# EAGLE design espPixel (EAGLE 9.6.2)
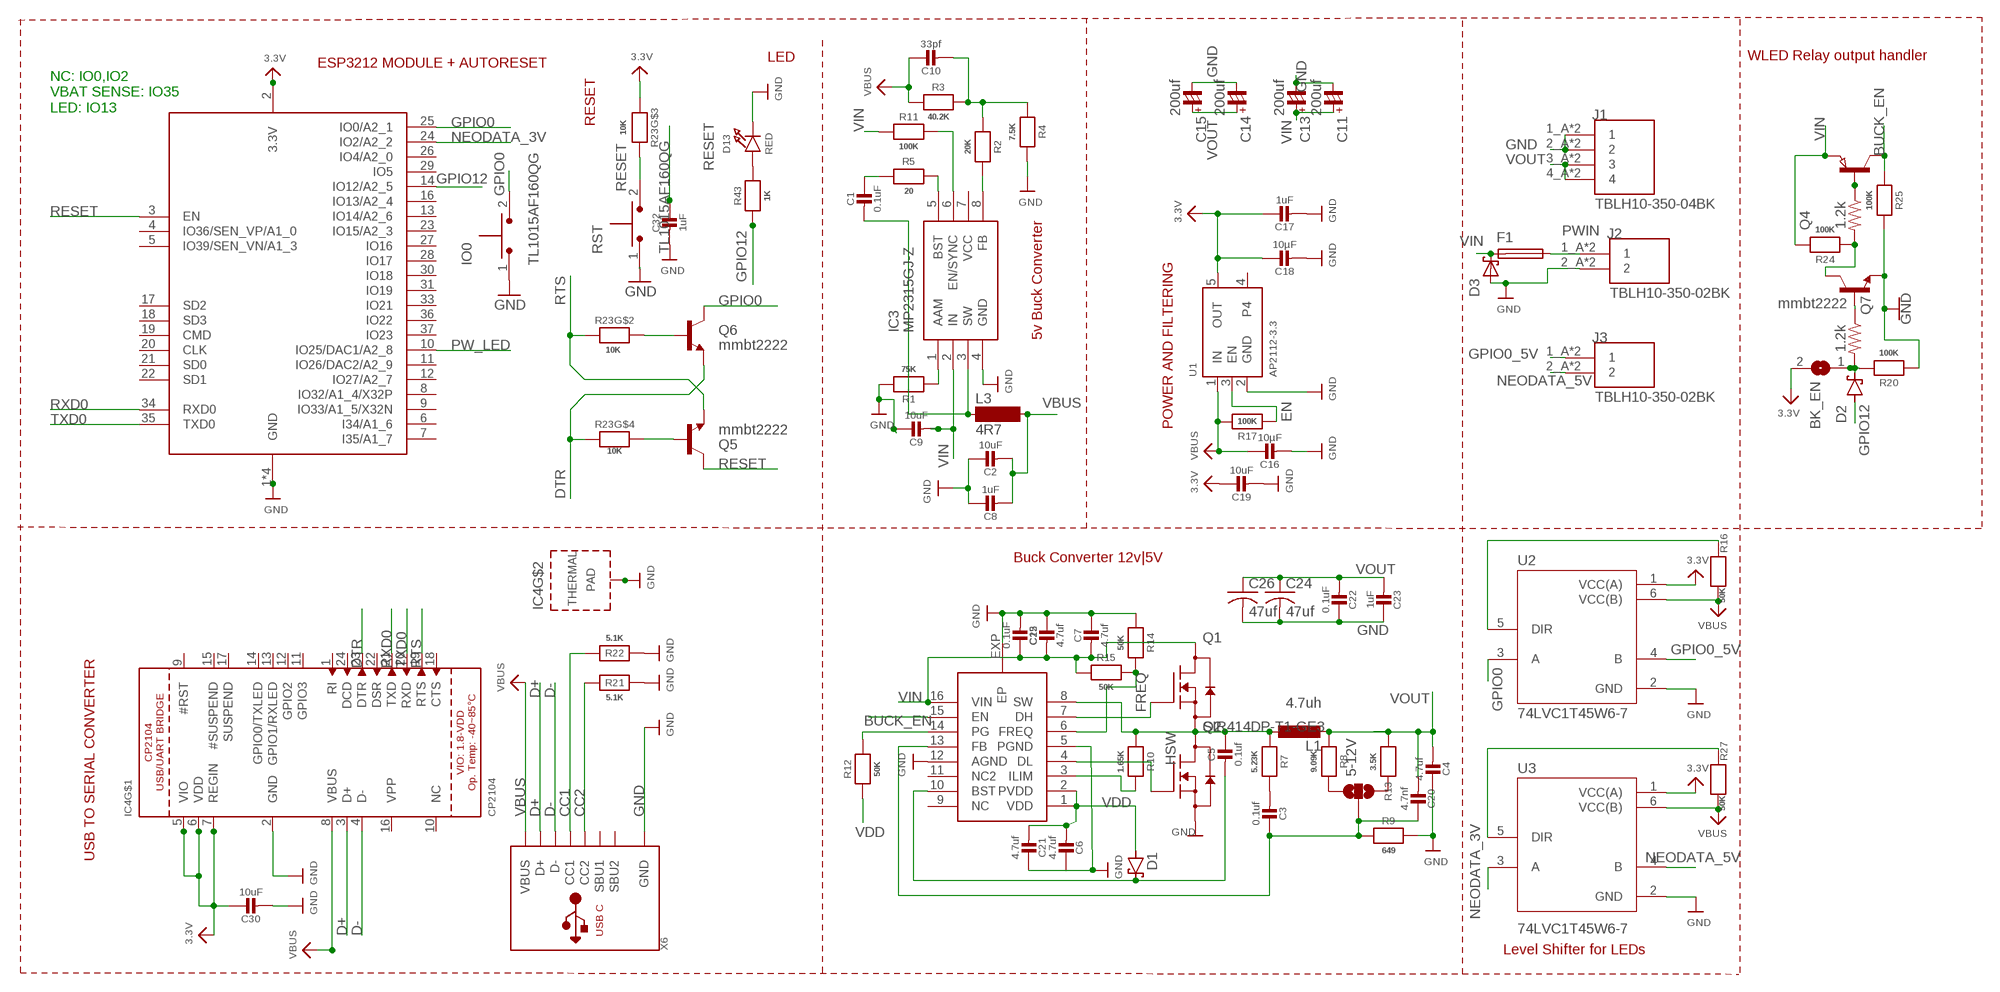
[diagram p0: schematic, sheet 1]

## Parts
5-12V  JUMPER-SMT_3_NO_NO-SILK  [SMT-JUMPER_3_NO_NO-SILK]
BK_EN  SJ  [SJ]
C1  0.1uF  CAP_CERAMIC0603_NO  [0603-NO@1]
C2  10uF  CAP_CERAMIC0603_NO  [0603-NO@1]
C3  0.1uf  CAP_CERAMIC0603_NO  [0603-NO@1]
C4  4.7uf  CAP_CERAMIC0805_10MGAP  [0805_10MGAP]
C5  0.1uf  CAP_CERAMIC0603_NO  [0603-NO@1]
C6  4.7uf  CAP_CERAMIC0603_NO  [0603-NO@1]
C7  4.7uf  CAP_CERAMIC0805_10MGAP  [0805_10MGAP]
C8  1uF  CAP_CERAMIC0603_NO  [0603-NO@1]
C9  10uF  CAP_CERAMIC0805_10MGAP  [0805_10MGAP]
C10  33pf  CAP_CERAMIC0603_NO  [0603-NO@1]
C11  200uf  CP_SV-E/F  [CSV-E/F]
C12  4.7uf  CAP_CERAMIC0805_10MGAP  [0805_10MGAP]
C13  200uf  CP_SV-E/F  [CSV-E/F]
C14  200uf  CP_SV-E/F  [CSV-E/F]
C15  200uf  CP_SV-E/F  [CSV-E/F]
C16  10µF  CAP_CERAMIC0805-NOOUTLINE  [0805-NO]
C17  1uF  CAP_CERAMIC0603_NO  [0603-NO@1]
C18  10µF  CAP_CERAMIC0805-NOOUTLINE  [0805-NO]
C19  10uF  CAP_CERAMIC0805-NOOUTLINE  [0805-NO]
C20  4.7nf  CAP_CERAMIC0603_NO  [0603-NO@1]
C21  4.7uf  CAP_CERAMIC0603_NO  [0603-NO@1]
C22  0.1uF  CAP_CERAMIC0603_NO  [0603-NO@1]
C23  1uF  CAP_CERAMIC0603_NO  [0603-NO@1]
C24  47uf  C-USC3225  [C3225]
C25  0.1uF  CAP_CERAMIC0603_NO  [0603-NO@1]
C26  47uf  C-USC3225  [C3225]
C30  10uF  CAP_CERAMIC0805-NOOUTLINE  [0805-NO]
C32  1uF  CAP_CERAMIC0603_NO  [0603-NO@1]
D1  BAT60J  [SOD323_ST]
D2  BAT60J  [SOD323_ST]
D3  SCHOTTKY-DIODESMC  [SMC]
D13  RED  LED0805_NOOUTLINE  [CHIPLED_0805_NOOUTLINE]
F1  SMD-MICRO-FUSE-BLOCK  [OMNIBLOK]
IC3  MP2315GJ-Z  [SOT65P280X100-8N]
IC4  CP2104  [QFN24_4MM_SMSC]
IO0  TL1015AF160QG  [SW_TL1015AF160QG]
J1  TBLH10-350-04BK  [CUI_TBLH10-350-04BK]
J2  TBLH10-350-02BK  [CUI_TBLH10-350-02BK]
J3  TBLH10-350-02BK  [CUI_TBLH10-350-02BK]
L1  4.7uh  L-EUCEP125  [CEP125]
L3  4R7  MS50  [MS50]
Q1  SIR414DP-T1-GE3  [TRANS_SQJ461EP-T1-GE3]
Q2  SIR414DP-T1-GE3  [TRANS_SQJ461EP-T1-GE3]
Q4  PNP-TRANSISTOR_SOT23  [SOT23]
Q5  mmbt2222  TRANSISTOR_NPNSOT23-3  [SOT23-3]
Q6  mmbt2222  TRANSISTOR_NPNSOT23-3  [SOT23-3]
Q7  mmbt2222  TRANSISTOR_NPNSOT23-3  [SOT23-3]
R1  75K  RESISTOR_0603_NOOUT  [0603-NO]
R2  20K  RESISTOR_0603_NOOUT  [0603-NO]
R3  40.2K  RESISTOR_0603_NOOUT  [0603-NO]
R4  7.5K  RESISTOR_0603_NOOUT  [0603-NO]
R5  20  RESISTOR_0603_NOOUT  [0603-NO]
R6  1.2k  RESISTOR0603  [0603]
R7  5.23K  RESISTOR_0603_NOOUT  [0603-NO]
R8  9.09K  RESISTOR_0603_NOOUT  [0603-NO]
R9  649  RESISTOR_0603_NOOUT  [0603-NO]
R10  1.65K  RESISTOR_0603_NOOUT  [0603-NO]
R11  100K  RESISTOR_0603_NOOUT  [0603-NO]
R12  50K  RESISTOR_0603_NOOUT  [0603-NO]
R13  3.5K  RESISTOR_0603_NOOUT  [0603-NO]
R14  50K  RESISTOR_0603_NOOUT  [0603-NO]
R15  50K  RESISTOR_0603_NOOUT  [0603-NO]
R16  50K  RESISTOR_0603_NOOUT  [0603-NO]
R17  100K  RESISTOR_0603_NOOUT  [0603-NO]
R19  1.2k  RESISTOR0603  [0603]
R20  100K  RESISTOR_0603_NOOUT  [0603-NO]
R21  5.1K  RESISTOR_0603_NOOUT  [0603-NO]
R22  5.1K  RESISTOR_0603_NOOUT  [0603-NO]
R23  10K  RESISTOR_4PACK  [RESPACK_4X0603]
R24  100K  RESISTOR_0603_NOOUT  [0603-NO]
R25  100K  RESISTOR_0603_NOOUT  [0603-NO]
R27  50K  RESISTOR_0603_NOOUT  [0603-NO]
R43  1K  RESISTOR_0603_NOOUT  [0603-NO]
RST  TL1015AF160QG  [SW_TL1015AF160QG]
U1  AP2112-3.3  VREG_SOT23-5  [SOT23-5]
U2  74LVC1T45W6-7  [SOT95P285X140-6N]
U3  74LVC1T45W6-7  [SOT95P285X140-6N]
U$1  MIC2101QFN16  [QFN16]
X6  USB_C  [USB_C_CUSB31-CFM2AX-01-X]
X8  ESP32_WROOM32_SKINNY  [WROOM32_SKINNY]

## Nets
3.3V: BK_EN.2 C17.1 C18.1 C19.1 C30.1 IC4.5(VIO) IC4.6(VDD) IC4.7(REGIN) R23.3 U1.5(OUT) U2.1(VCC(A)) U3.1(VCC(A)) X8.2(3.3V)
BUCK_EN: Q4.3(C) R25.1 U$1.15(EN)
CC1: R22.2 X6.A5(CC1)
CC2: R21.2 X6.B5(CC2)
D+: IC4.3(D+) X6.A6(D+) X6.B6(D+)
D-: IC4.4(D-) X6.A7(D-) X6.B7(D-)
DTR: IC4.23(DTR) Q6.2(E) R23.4
EN: R17.1 U1.3(EN)
FREQ: R14.2 R15.2 U$1.6(FREQ)
GND: C2.1 C4.1 C6.1 C7.1 C8.1 C9.1 C11.- C12.1 C13.- C14.- C15.- C16.2 C17.2 C18.2 C19.2 C21.1 C22.1 C23.1 C24.2 C25.2 C26.2 C30.2 C32.2 D3.A D13.C IC3.4(GND) IC4.2(GND) IC4.THERM(TP) IO0.1 J1.1_A J1.1_B J1.2_A J1.2_B J2.2_A J2.2_B Q2.1(S) Q2.2(S) Q2.3(S) Q7.2(E) R1.2 R4.2 R9.2 R14.1 R20.1 R21.1 R22.1 R25.2 RST.1 U1.2(GND) U2.2(GND) U3.2(GND) U$1.5(PGND) U$1.12(AGND) U$1.EXP(EP) X6.A1B12(GND) X6.B1A12(GND) X8.1(GND) X8.15(GND) X8.38(GND) X8.P$1(GND)
GPIO0: IO0.2 Q6.3(C) U2.3(A) X8.25(IO0/A2_1)
GPIO0_5V: J3.1_A J3.1_B U2.4(B)
GPIO12: D2.A R43.1 X8.14(IO12/A2_5)
HSW: C5.1 L1.1 Q1.1(S) Q1.2(S) Q1.3(S) Q2.5(D) Q2.6(D) Q2.7(D) Q2.8(D) Q2.9(D) R7.1 R10.1 U$1.8(SW)
N$1: IC3.8(FB) R2.2
N$2: C10.2 R2.1 R3.2 R4.1
N$3: IC3.5(BST) R5.2
N$4: IC3.1(AAM) R1.1
N$5: IC3.6(EN/SYNC) R11.2
N$6: C1.1 R5.1
N$7: R12.2 U$1.14(PG)
N$8: C3.2 R7.2
N$9: BK_EN.1 D2.C R6.2 R20.2
N$10: R27.1 U3.5(DIR)
N$11: 5-12V.2 C3.1 C20.1 R9.1 U$1.13(FB)
N$12: Q2.4(G) U$1.4(DL)
N$13: Q1.4(G) U$1.7(DH)
N$14: R10.2 U$1.3(ILIM)
N$15: C5.2 D1.C U$1.10(BST)
N$17: 5-12V.1 R8.2
N$18: 5-12V.3 R13.2
N$21: D13.A R43.2
N$23: Q7.1(B) R6.1
N$24: Q4.1(B) R19.1
N$25: C1.2 IC3.3(SW) L3.1
N$26: Q7.3(C) R19.2 R24.1
N$28: R16.1 U2.5(DIR)
N$45: Q5.1(B) R23.5
N$48: Q6.1(B) R23.7
NEODATA_3V: U3.3(A) X8.24(IO2/A2_2)
NEODATA_5V: J3.2_A J3.2_B U3.4(B)
PW_LED: X8.10(IO25/DAC1/A2_8)
PWIN: F1.P$1 J2.1_A J2.1_B
RESET: C32.1 Q5.3(C) R23.6 RST.2 X8.3(EN)
RTS: IC4.19(RTS) Q5.2(E) R23.2
RXD0: IC4.21(TXD) X8.34(RXD0)
TXD0: IC4.20(RXD) X8.35(TXD0)
VBUS: C2.2 C8.2 C10.1 C16.1 IC4.8(VBUS) L3.2 R3.1 R16.2 R17.2 R27.2 U1.1(IN) U2.6(VCC(B)) U3.6(VCC(B)) X6.A4B9(VBUS) X6.B4A9(VBUS)
VDD: C6.2 C21.2 D1.A R12.1 U$1.1(VDD) U$1.2(PVDD)
VIN: C7.2 C9.2 C11.+ C12.2 C13.+ C25.1 D3.C F1.P$2 IC3.2(IN) Q1.5(D) Q1.6(D) Q1.7(D) Q1.8(D) Q1.9(D) Q4.2(E) R11.1 R15.1 R24.2 U$1.16(VIN)
VOUT: C4.2 C14.+ C15.+ C20.2 C22.2 C23.2 C24.1 C26.1 J1.3_A J1.3_B J1.4_A J1.4_B L1.2 R8.1 R13.1
Unconnected: IC3.7(VCC) IC4.1(RI) IC4.9(#RST) IC4.10(NC) IC4.11(GPIO3) IC4.12(GPIO2) IC4.13(GPIO1/RXLED) IC4.14(GPIO0/TXLED) IC4.15(#SUSPEND) IC4.16(VPP) IC4.17(SUSPEND) IC4.18(CTS) IC4.22(DSR) IC4.24(DCD) R23.1 R23.8 U1.4 U$1.9(NC) U$1.11(NC2) X6.A8(SBU1) X6.B8(SBU2) X8.4(IO36/SEN_VP/A1_0) X8.5(IO39/SEN_VN/A1_3) X8.6(I34/A1_6) X8.7(I35/A1_7) X8.8(IO32/A1_4/X32P) X8.9(IO33/A1_5/X32N) X8.11(IO26/DAC2/A2_9) X8.12(IO27/A2_7) X8.13(IO14/A2_6) X8.16(IO13/A2_4) X8.17(SD2) X8.18(SD3) X8.19(CMD) X8.20(CLK) X8.21(SD0) X8.22(SD1) X8.23(IO15/A2_3) X8.26(IO4/A2_0) X8.27(IO16) X8.28(IO17) X8.29(IO5) X8.30(IO18) X8.31(IO19) X8.33(IO21) X8.36(IO22) X8.37(IO23)

## Notes on the sheet
- WLED Relay output handler
- LED
- ESP3212 MODULE + AUTORESET
- NC: IO0,IO2
  VBAT SENSE: IO35
  LED: IO13
- RESET
- 5v Buck Converter
- POWER AND FILTERING
- Buck Converter 12v|5V
- USB TO SERIAL CONVERTER
- Level Shifter for LEDs

## Library data of the parts
5-12V = SparkFun-Jumpers:JUMPER-SMT_3_NO: Normally open jumper This jumper has three pads in close proximity to each other. Apply solder to close the connection(s).
BK_EN = jumper:SJ: SMD solder JUMPER
C1-C10 C12 C16-C23 C25 C30 C32 = microbuilder:CAP_CERAMIC: Ceramic Capacitors For new designs, use the packages preceded by an '_' character since they are more reliable: The following footprints should be used on most boards: _0402 - Standard footprint for regular board layouts _0603 - Standard footprint for regular board layouts _0805 - Standard footprint for regular board layouts _1206 - Standard footprint for regular board layouts For extremely tight-pitch boards where space is at a premium, the following 'micro-pitch' footprints can be used (smaller pads, no silkscreen outline, etc.): _0402MP - Micro-pitch footprint for very dense/compact boards _0603MP - Micro-pitch footprint for very dense/compact boards _0805MP - Micro-pitch footprint for very dense/compact boards _1206MP - Micro-pitch footprint for very dense/compact boards
C11 C13-C15 = rc-master-smd:CP_: POLARIZED CAP
C24 C26 = adafruit:C-US: CAPACITOR, American symbol
D1 D2 = diode:BAT60J: Schottky barrier diode Source: www.st.com, BAT60J.pdf
D3 = diode:SCHOTTKY-DIODE: Schottky Diode
D13 = microbuilder:LED: LED 0603 - 0603 Surface Mount Package 2mA: Green LED - Low Power (3.9mcd, 2ma, 1.7Vf) - Digikey: 475-2709-2-ND Orange LED - Low Power (9.8mcd, 2ma, 1.8Vf) - Digikey: 475-1194-2-ND Red LED - Low Power (5mcd, 2ma, 1.8Vf) - Digikey: 475-1195-2-ND Yellow LED - Low Power (7mcd, 2ma, 1.8Vf) - Digikey: 475-1196-2-ND 5mA: Blue LED - Low Power (17mcd, 5ma, 2.9Vf) - Digikey: LNJ937W8CRACT-ND 0805 - 0805 Surface Mount Package 2mA: Red LED (8.8mcd, 2mA, 1.8Vf, Clear) - Low Power [Digikey: 475-2510-1-ND] Green LED (5mcd, 2mA, 1.8Vf, Clear) - Low Power [Digikey: 475-2730-1-ND] Yellow LED (11.3mcd, 2mA, 1.8Vf, Clear) - Low Power [Digikey: 475-2555-1-ND] 20mA: Red LED (104mcd, 20mA, Diffused) - LS R976 [Digikey: 475-1278-6-ND] Red LED (12mcd, 20mA, 2.0Vf, Clear) - APT2012EC [Digikey: 754-1128-1-ND] Green LED (15mcd, 20mA, 2.2Vf, Clear) - APT2012GC [Digikey: 754-1131-1-ND] Orange LED (160mcd, 20mA, 2.1Vf, Clear) - APT2012SECK [Digikey: 754-1130-1-ND] 1206 - 1206 Surface Mount Package Green LED (26mcd, 20mA, Diffused) - LG N971 [Digikey: 475-1407-6-ND] Red LED (15mcd, 20mA, Diffused) - LH N974 [Digikey: 475-1416-6-ND] Cree - Cree High-Power Surface Mount LEDs XPEBWT-L1-0000-00D50 - White 111lm 350mA 2.9Vf 6200K 110° XTEAWT-00-0000-00000LEE3 - White 114lm 350mA 2.85Vf 5000K 115° Everlight - Everlight 45-21 Series Surface Mount LEDs 45-21/QK2C-B2832AC2CB2/2T - Warm White 2000mcd 20mA 3.25Vf 3050K 120° 45-21/LK2C-B38452C4CB2/2T - Nuetral White 2000mcd 20mA 3.25Vf 4150K 120° 45-21/LK2C-B50634C6CB2/2T - Cold White 2200mcd 20mA 3.25Vf 5650K 120° PLCC2 Reverse Mount LS T77K-J1L2-1-0-2-R18-Z - Red 11.25mcd 2mA 1.8Vf 630nm 120° LO T77K-L1M2-24-Z - Orange 19.6mcd 2mA 1.8Vf 606nm 120° LY T77K-K2M1-26-Z - Yellow 15.7mcd 2mA 1.8Vf 587nm 120°
F1 = f-lf-omniblok-s:SMD-MICRO-FUSE
IC3 = MP2315GJ-Z:MP2315GJ-Z: Switching Voltage Regulators 3A 24V 500kHz Sync buck Source: Datasheet <https://componentsearchengine.com/Datasheets/1/MP2315GJ-Z.pdf>; DESCRIPTION: Switching Voltage Regulators 3A 24V 500kHz Sync buck; HEIGHT: 1mm; MANUFACTURER_NAME: Monolithic Power Systems (MPS); MANUFACTURER_PART_NUMBER: MP2315GJ-Z; MOUSER_PART_NUMBER: 946-MP2315GJZ; MOUSER_PRICE-STOCK: https://www.mouser.co.uk/ProductDetail/Monolithic-Power-Systems-MPS/MP2315GJ-Z?qs=QEkzKklKf2QEN5VKd%252Br2GQ%3D%3D
IC4 = microbuilder:CP2104: CP2104 - USB to UART Bridge VDD Output: 3.45V
IO0 RST = TL1015AF160QG:TL1015AF160QG: Tactile Switch SPST-NO Top Actuated Surface Mount; AVAILABILITY: Unavailable; DESCRIPTION: Tactile Switch SPST-NO Top Actuated Surface Mount; MF: E-Switch; MP: TL1015AF160QG; PACKAGE: SOIC-14 E-Switch; PRICE: None
J1 = TBLH10-350-04BK:TBLH10-350-04BK; AVAILABILITY: Unavailable; CUI_PURCHASE_URL: https://www.cuidevices.com/product/interconnect/connectors/terminal-blocks/tblh10-350-series?utm_source=snapeda.com&utm_medium=referral&utm_campaign=snapedaBOM; DESCRIPTION: 2~24 Poles, Screwless, Horizontal, 3.50 Pitch, 24~16 (AWG), Terminal Block Connector; DIGIKEY-PURCHASE-URL: https://snapeda.com/shop?store=DigiKey&id=3655790; MF: CUI Devices; MP: TBLH10-350-04BK; PACKAGE: None; PRICE: None
J2 J3 = TBLH10-350-02BK:TBLH10-350-02BK; AVAILABILITY: Unavailable; CUI_PURCHASE_URL: https://www.cuidevices.com/product/interconnect/connectors/terminal-blocks/tblh10-350-series?utm_source=snapeda.com&utm_medium=referral&utm_campaign=snapedaBOM; DESCRIPTION: 2~24 Poles, Screwless, Horizontal, 3.50 Pitch, 24~16 (AWG), Terminal Block Connector; DIGIKEY-PURCHASE-URL: https://snapeda.com/shop?store=DigiKey&id=3655793; MF: CUI Devices; MP: TBLH10-350-02BK; PACKAGE: None; PRICE: None
L1 = rcl:L-EU: INDUCTOR, European symbol; SPICEPREFIX: L
L3 = inductor-neosid:MS50: INDUCTOR SMD power inductor; OC_FARNELL: unknown; OC_NEWARK: unknown
Q1 Q2 = SIR414DP-T1-GE3:SIR414DP-T1-GE3: Single N-Channel 40 V 0.0028 Ohm SMT TrenchFET Power Mosfet - PowerPak-SO-8; AVAILABILITY: Unavailable; DESCRIPTION: N-Channel 40V 50A (Tc) 5.4W (Ta), 83W (Tc) Surface Mount PowerPAK® SO-8; MF: Vishay Siliconix; MP: SIR414DP-T1-GE3; PACKAGE: SO-8 Vishay Siliconix; PRICE: None
Q4 = semicon-smd-ipc:PNP-TRANSISTOR_: PNP TRANSISTOR
Q5-Q7 = SparkFun:TRANSISTOR_NPN: Transistor NPN BJT configuration in SOT23 package. MMBT2222 is the common NPN we use. Double check BCE configuration again layout.
R1-R5 R7-R17 R20-R22 R24 R25 R27 R43 = microbuilder:RESISTOR: Resistors For new designs, use the packages preceded by an '_' character since they are more reliable: The following footprints should be used on most boards: _0402 - Standard footprint for regular board layouts _0603 - Standard footprint for regular board layouts _0805 - Standard footprint for regular board layouts _1206 - Standard footprint for regular board layouts For extremely tight-pitch boards where space is at a premium, the following 'micro-pitch' footprints can be used (smaller pads, no silkscreen outline, etc.): _0402MP - Micro-pitch footprint for very dense/compact boards _0603MP - Micro-pitch footprint for very dense/compact boards _0805MP - Micro-pitch footprint for very dense/compact boards _1206MP - Micro-pitch footprint for very dense/compact boards
R6 R19 = SparkFun-Resistors:RESISTOR: Generic Resistor Package
R23 = microbuilder:RESISTOR_4PACK: Resistor Packs (4 resistors) 4 x 0603 10K 1/16W - Digikey: YC164J-10KCT-ND
U1 = microbuilder:VREG_SOT23-5: SOT23-5 Fixed Voltage Regulators Part Current Out V Out V In V Dropout θJA (°C/W) TJ (°C) Digikey Part No. ADP121 150mA 3.3V 3.4-5.5V 0.09V @ 150mA -- -- ADP121-AUJZ33R7CT-ND ADP121 150mA 3.0V 3.1-5.5V 0.09V @ 150mA -- -- ADP121-AUJZ30R7CT-ND ADP122 300mA 3.3V 3.4-5.5V 0.085V @ 300mA -- -- ADP122AUJZ-3.3-R7CT-ND ADP1712 300mA 3.3V 3.5-5.5V 0.17V @ 300mA -- -- ADP1712AUJZ-3.3-R7TR-ND AP7311 (Low Cost) 150mA 3.3V 3.5-6V 0.15V @ 150mA -- -- AP7311-33WG-7DICT-ND LD39015M18R 150mA 1.8V 1.9V-5.5V 0.08V @ 100mA -- -- 497-6977-1-ND LP2985A-33DBVR 150mA 3.3V 3.3-16V 0.28V @ 150mA 206 150 296-18479-1-ND MCP1824T-3302E/OT 300mA 3.3V 3.5V-6V 0.2V @ 300mA -- -- MCP1824T-3302E/OTCT-ND MIC5205-2.5YM5 TR 150mA 2.5V 2.7-16V 0.165V @ 150mA -- -- 576-1257-2-ND MIC5205-3.0YM5 TR 150mA 3.0V 3.2V-16V 0.165V @ 150mA -- -- 576-1258-2-ND MIC5205-3.3YM5 TR 150mA 3.3V 3.5V-16V 0.165V @ 150mA -- -- 576-1259-2-ND TPS780330220 150mA 3.3V+2.2V 3.6-5.5V 250mV Max -- -- 296-23332-1-ND TDA3663/N1,135 100mA 3.3V 3.5-45V 0.18V @ 50mA -- -- 568-5343-1-ND Max operating temp can be calculated using θJA, TJ (max junction temperature), and power in watts. Set the "Maximum Ambient Temperature" until it reaches TJ ("Max Junction Temperature"), which is the absolute limit for safe use of the regulator: Heat Sink Temperature Calculator <http://www.daycounter.com/Calculators/Heat-Sink-Temperature-Calculator.phtml> For example, With 12V source into a 3.3V LP2985 and a 30mA load, we are dissipating (12V-3.3V) * 0.03A = 0.261W. With a θJA of 206 °C/W, a TJ of 150°C, and 261mW we can safely use the chip without a heat sink up to 75°C (=147.1°C Junction Temperature).
U2 U3 = 74LVC1T45W6-7:74LVC1T45W6-7: 74LVC Series 5.5 V 3-State SMT Single Bit Dual Supply Transceiver - SOT-26 Check prices <https://pricing.snapeda.com/parts/74LVC1T45W6-7/Diodes%20Inc./view-part?ref=eda>; AVAILABILITY: Warning; DESCRIPTION: Voltage Level Translator Bidirectional 1 Circuit 1 Channel SOT-26; MF: Diodes Inc.; MP: 74LVC1T45W6-7; PACKAGE: SOT-23-6 Diodes Inc.; PRICE: None; PURCHASE-URL: https://pricing.snapeda.com/search/part/74LVC1T45W6-7/?ref=eda
U$1 = MIC2101:MIC2101
X6 = microbuilder:USB_C: USB Type-C USB 2.0 Connector
X8 = microbuilder:ESP32_WROOM32

## Board
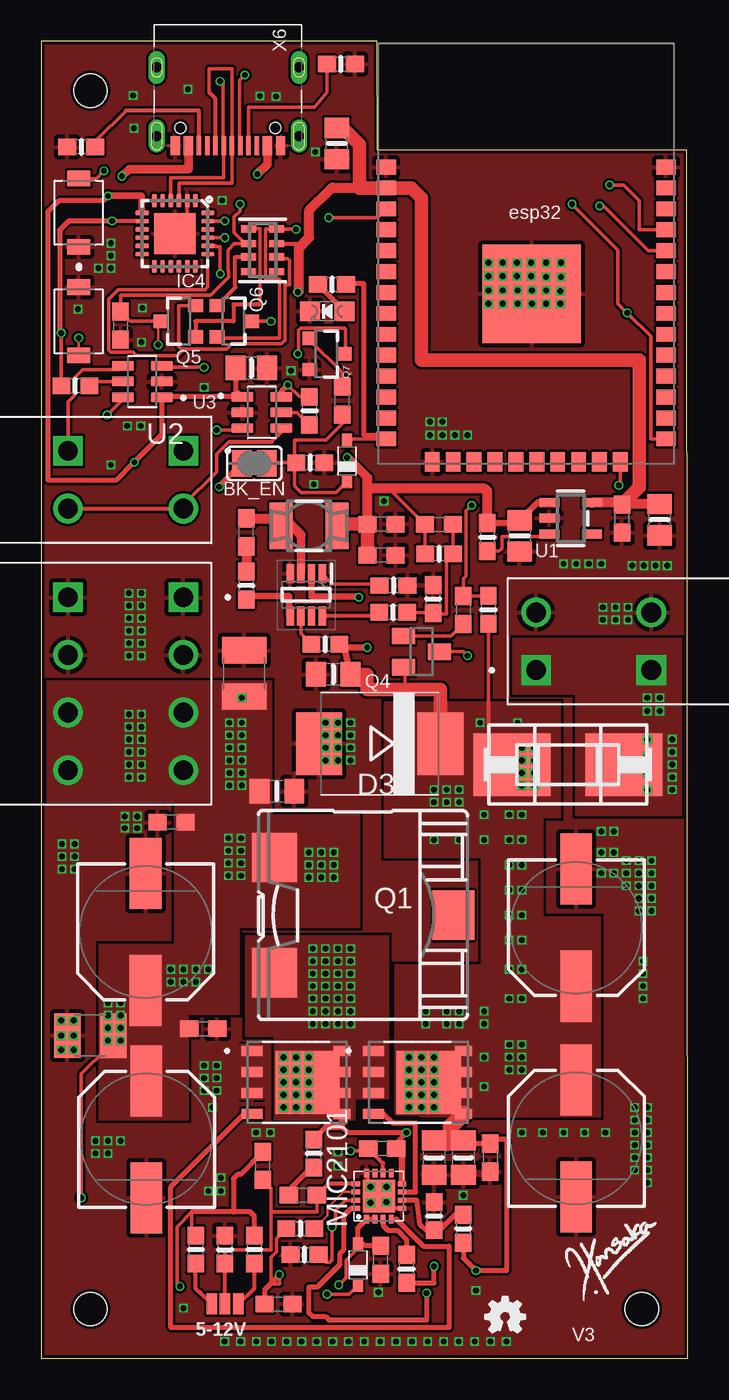
[diagram p1: board, top side]
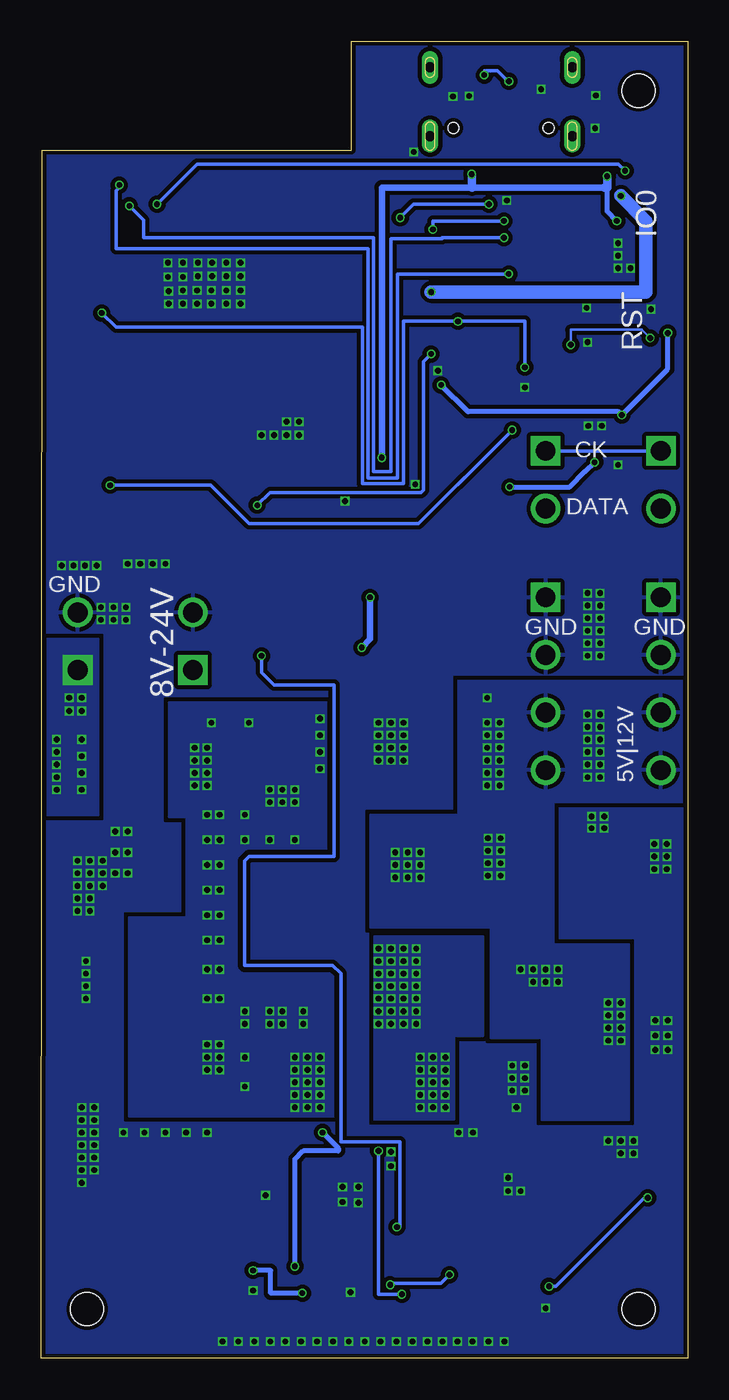
[diagram p2: board, bottom side, seen from below]

Size 39.29 x 80.01 mm. Coordinates in mm from the lower left corner, seen from the top.
Outline: 0,0 39.29,0 39.24,73.4 20.43,73.4 20.42,80.01 0,80 0,0
Copper layers (1*16): Top 0.035559375mm / dielectric 1.6mm / Bottom 0.035559375mm
Design rules "jlcpcb2layer": minimum track width 5mil, minimum drill 12mil, track to track 5mil, track to pad 5mil, pad to pad 5mil, via to via 5mil, smd to smd 5mil, copper to edge 8mil, drill to drill 6mil, minimum pad ring 5mil, minimum via ring 3mil, stop-mask expansion 2.5mil, vias tented up to drill 0mil, thermal gap 10mil
Holes 2 mm at 36.5,3 3,3 3,77

### Footprints (pad centres in the part's own frame; a part is rotated, then mirrored left to right if it is on the bottom)
SMT-JUMPER_3_NO_NO-SILK = smd 0.635 x 1.27: 1 -0.813,0; 2 0,0; 3 0.813,0
SJ = smd 1.168 x 1.6: 1 -0.762,0; 2 0.762,0
0603-NO@1 = smd 1.1 x 1: 1 -0.85,0; 2 0.85,0
0805_10MGAP = smd 1.2 x 1.5: 1 -1.05,0; 2 1.05,0
CSV-E/F = smd 4.318 x 1.93: + -3.556,0; - 3.556,0
0805-NO = smd 1.24 x 1.5: 1 -0.95,0; 2 0.95,0
C3225 = smd 1.6 x 2.7: 1 -1.4,0; 2 1.4,0
SOD323_ST = smd 0.8 x 0.6: A 1.25,0; C -1.25,0
SMC = smd 2.8 x 3.8: A 3.7,0; C -3.7,0
CHIPLED_0805_NOOUTLINE = smd 1.2 x 1.2: A 0,-1.05; C 0,1.05
OMNIBLOK = smd 4.7 x 3.8: P$1 -3.4,0; P$2 3.4,0
SOT65P280X100-8N = smd 1.15 x 0.45: 1 -1.3,0.975; 2 -1.3,0.325; 3 -1.3,-0.325; 4 -1.3,-0.975; 5 1.3,-0.975; 6 1.3,-0.325; 7 1.3,0.325; 8 1.3,0.975
QFN24_4MM_SMSC = smd 0.8 x 0.28: 1 -2,1.25; 2 -2,0.75; 3 -2,0.25; 4 -2,-0.25; 5 -2,-0.75; 6 -2,-1.25; 13 2,-1.25; 14 2,-0.75; 15 2,-0.25; 16 2,0.25; 17 2,0.75; 18 2,1.25 | smd 0.28 x 0.8: 7 -1.25,-2; 8 -0.75,-2; 9 -0.25,-2; 10 0.25,-2; 11 0.75,-2; 12 1.25,-2; 19 1.25,2; 20 0.75,2; 21 0.25,2; 22 -0.25,2; 23 -0.75,2; 24 -1.25,2 | smd 2.5 x 2.5: THERM 0,0
SW_TL1015AF160QG = smd 0.95 x 1.4: 1 -2.075,0; 2 2.075,0
CUI_TBLH10-350-04BK = drill 1.2 square: 1_A 0,0; 1_B 0,-7 | drill 1.2: 2_A 3.5,0; 2_B 3.5,-7; 3_A 7,0; 3_B 7,-7; 4_A 10.5,0; 4_B 10.5,-7
CUI_TBLH10-350-02BK = drill 1.2 square: 1_A 0,0; 1_B 0,-7 | drill 1.2: 2_A 3.5,0; 2_B 3.5,-7
CEP125 = smd 3 x 2.75: 1 -3.5,5.375; 2 3.5,5.375 | smd 3 x 2.55: 3 0,-5.48
MS50 = smd 2.8 x 1.4: 1 0,-1.7; 2 0,1.7
TRANS_SQJ461EP-T1-GE3 = smd 1.27 x 0.61: 1 -2.67,1.905; 2 -2.67,0.635; 3 -2.67,-0.635; 4 -2.67,-1.905 | smd 1.02 x 0.61: 5 2.795,-1.905; 6 2.795,-0.635; 7 2.795,0.635; 8 2.795,1.905 | smd 3.91 x 3.81: 9 0.69,0
SOT23 = smd 1 x 1.4: 1 -0.95,-1.1; 2 0.95,-1.1; 3 0,1.1
SOT23-3 = smd 0.8 x 0.9: 1 -0.95,-1; 2 0.95,-1; 3 0,1.1
0603-NO = smd 1.075 x 1: 1 -0.85,0; 2 0.85,0
0603 = smd 1.1 x 1: 1 -0.85,0; 2 0.85,0
RESPACK_4X0603 = smd 0.45 x 0.9: 1 -1.3,-0.85; 2 -0.4,-0.85; 3 0.4,-0.85; 4 1.3,-0.85; 5 1.3,0.85; 6 0.4,0.85; 7 -0.4,0.85; 8 -1.3,0.85
SOT23-5 = smd 0.55 x 1.2: 1 -0.95,-1.3; 2 0,-1.3; 3 0.95,-1.3; 4 0.95,1.3; 5 -0.95,1.3
SOT95P285X140-6N = smd 1.35 x 0.6: 1 -1.185,0.95; 2 -1.185,0; 3 -1.185,-0.95; 4 1.185,-0.95; 5 1.185,0; 6 1.185,0.95
QFN16 = smd 0.5 x 0.3: 1 -1.4,0.75; 2 -1.4,0.25; 3 -1.4,-0.25; 4 -1.4,-0.75; 9 1.4,-0.75; 10 1.4,-0.25; 11 1.4,0.25; 12 1.4,0.75 | smd 0.3 x 0.5: 5 -0.75,-1.4; 6 -0.25,-1.4; 7 0.25,-1.4; 8 0.75,-1.4; 13 0.75,1.4; 14 0.25,1.4; 15 -0.25,1.4; 16 -0.75,1.4 | smd 1.95 x 1.95: EXP 0,0
USB_C_CUSB31-CFM2AX-01-X = smd 0.575 x 1.15: A1B12 -3.2,3.545; A4B9 -2.4,3.545; B1A12 3.2,3.545; B4A9 2.4,3.545 | smd 0.275 x 1.15: A5 -1.25,3.545; A6 -0.25,3.545; A7 0.25,3.545; A8 1.25,3.545; B5 1.75,3.545; B6 0.75,3.545; B7 -0.75,3.545; B8 -1.75,3.545 | drill 0.6 pad 1 long: M1 -4.32,2.97; M2 4.32,2.97; M3 -4.32,-1.21; M4 4.32,-1.21 | hole 0.65: 2.89,2.47; -2.89,2.47
WROOM32_SKINNY = smd 1.2 x 0.9: 1 -8.5,5; 2 -8.5,3.73; 3 -8.5,2.46; 4 -8.5,1.19; 5 -8.5,-0.08; 6 -8.5,-1.35; 7 -8.5,-2.62; 8 -8.5,-3.89; 9 -8.5,-5.16; 10 -8.5,-6.43; 11 -8.5,-7.7; 12 -8.5,-8.97; 13 -8.5,-10.24; 14 -8.5,-11.51; 25 8.5,-11.51; 26 8.5,-10.24; 27 8.5,-8.97; 28 8.5,-7.7; 29 8.5,-6.43; 30 8.5,-5.16; 31 8.5,-3.89; 32 8.5,-2.62; 33 8.5,-1.35; 34 8.5,-0.08; 35 8.5,1.19; 36 8.5,2.46; 37 8.5,3.73; 38 8.5,5 | smd 0.9 x 1.2: 15 -5.7,-12.9; 16 -4.43,-12.9; 17 -3.16,-12.9; 18 -1.89,-12.9; 19 -0.62,-12.9; 20 0.65,-12.9; 21 1.92,-12.9; 22 3.19,-12.9; 23 4.46,-12.9; 24 5.73,-12.9 | smd 6 x 6: P$1 0.34,-2.7

### Placement (x,y rotation side)
5-12V  11.18,3.3 180 top
BK_EN  12.95,54.36 180 top
C1  12.47,50.17 90 top
C2  20.68,50.67 180 top
C3  15.9,9.91 180 top
C4  14.33,34.44 180 top
C5  20.73,12.75 180 top
C6  20.62,5.99 90 top
C7  23.88,12.19 90 top
C8  20.68,48.79 180 top
C9  17.75,41.55 0 top
C10  24.18,50.65 0 top
C11  32.51,26.16 90 top
C12  25.65,12.19 90 top
C13  32.51,13.36 270 top
C14  6.35,25.91 90 top
C15  6.4,13.31 270 top
C16  29.07,49.96 270 top
C17  35.29,51 270 top
C18  37.58,50.94 270 top
C19  12.78,60.16 0 top
C20  13.46,11.68 90 top
C21  14.43,3.3 180 top
C22  7.92,32.56 0 top
C23  9.86,20.02 180 top
C24  12.34,41.61 90 top
C25  27.28,12.19 270 top
C26  3,19.61 180 top
C30  17.96,73.79 270 top
C32  4.83,62.74 270 top
D1  19.25,5.69 90 top
D2  18.59,54.51 90 top
D3  20.57,37.34 180 top
D13  17.39,63.6 90 top
F1  32,36.07 180 top
IC3  16.1,46.38 270 top
IC4  8.13,68.33 270 top
IO0  2.29,69.6 90 top
J1  8.64,46.23 270 top
J2  30.07,41.81 90 top
J3  8.64,55.12 270 top
L1  19.56,26.92 90 top
L3  16.28,50.57 270 top
Q1  22.86,16.76 0 top
Q2  15.49,16.76 0 top
Q4  23.11,42.93 270 top
Q5  8.38,62.99 90 top
Q6  11.68,62.99 270 top
Q7  17.32,61.01 270 top
R1  21.41,46.94 0 top
R2  21.39,45.31 180 top
R3  24.18,48.87 0 top
R4  23.83,46.13 90 top
R5  12.46,46.94 270 top
R6  18.29,58.17 270 top
R7  16.56,12.45 270 top
R8  12.95,6.6 270 top
R9  11.18,6.6 90 top
R10  22.2,5.44 90 top
R11  17.27,43.38 180 top
R12  15.75,7.87 0 top
R13  9.4,6.6 270 top
R14  23.88,8.64 270 top
R15  25.65,7.87 90 top
R16  2.08,59.08 180 top
R17  27.11,49.89 90 top
R19  25.65,45.47 90 top
R20  16.36,54.41 180 top
R21  2.44,73.58 0 top
R22  18.22,78.62 180 top
R23  13.46,67.31 90 top
R24  27.18,45.47 270 top
R25  16,6.3 180 top
R27  16.31,57.56 90 top
R43  17.68,65.23 180 top
RST  2.29,62.99 270 top
U1  32.18,51.03 270 top
U2  6.15,59.33 180 top
U3  13.41,57.45 0 top
U$1  20.52,9.86 90 top
U$30  [OSHW-LOGO-MINI]  28.19,2.54 0 top
U$33  [SIGNATURE]  31.75,2.29 0 top
X6  11.35,77.21 180 top
X8  29.46,67.36 0 top

### Tracks (layer width: path | path; a pad name or v marks a point on that pad's centre or on a via)
3.3V  (via drill 0.35)
  Top 0.254: IC4.5 IC4.6 6.88,70.36 6.1,70.36 6.1,69.58 IC4.7 | R23.3 15.67,67.71 15.67,64.85 v15.6,64.77
  Top 0.305: 11.78,60.1 C19.1 11.83,58.8 U3.1 7.35,58.41 U2.1 7.33,56.1 v5.66,54.43 4.59,53.36 0.41,53.36 0.41,69.65 1.07,70.32 3.77,70.32 v4.06,70.61 | BK_EN.2 10.82,52.98 v10.82,52.93
  Top 0.406: v4.06,70.61 6.1,70.61 6.1,69.58
  Top 0.61: U1.5 35.16,51.98 C17.1 35.29,51.89 C18.1 | v15.6,64.77 15.65,64.82 15.65,67.45 16.29,68.09 16.29,69.73 17.68,71.12 19.31,71.12 19.34,71.09
  Top 0.813: C30.1 18.32,74.74 19.34,73.72 19.34,71.09 X8.2 22.49,71.09 23.11,70.47 23.11,60.63 36.35,60.63 36.35,52.91 C17.1
  Bottom 0.305: v5.66,54.43 6.21,53.88 6.22,53.88 7.17,52.93 v10.82,52.93
  Bottom 0.813: v15.6,64.77 2.54,64.77 2.54,69.09 v4.06,70.61
BUCK_EN  (via drill 0.35)
  Top 0.203: Q4.3 25.65,42.93 v25.91,42.67 | U$1.15 18.5,9.61 17.88,8.99 17.88,8.08 17.73,7.92 v17.68,7.98 17.68,5.99 17.53,5.84 17.31,5.84 R25.1
  Bottom 0.203: v25.91,42.67 25.91,41.66 25.15,40.89 21.49,40.89 21.49,30.48 26.67,30.48 26.92,30.23 26.92,23.88 21.59,23.88 21.08,23.37 21.08,13.16 17.48,13.16 17.48,7.98 v17.68,7.98
CC1
  Top 0.203: X6.A5 12.6,76.01 16.62,76.01 17.37,76.9 R22.2
CC2
  Top 0.203: 5.16,75.79 3.29,73.93 R21.2
  Top 0.254: X6.B5 9.6,75.79 5.16,75.79
D+
  Top 0.203: IC4.3 8.38,71.37 11.6,71.37 X6.A6 11.61,73.67 11.61,78.33 10.21,78.33 10.21,76.86
  Top 0.254: X6.B6 10.6,76.51 10.23,76.88 10.21,76.86
D-  (via drill 0.35)
  Top 0.203: IC4.4 7.87,71.73 11.1,71.73 X6.A7 11.05,73.71 11.05,77.57 v10.87,77.57 | v12.37,77.95 12.06,77.65 12.06,73.69 X6.B7
  Bottom 0.203: v10.87,77.57 10.95,77.57 11.58,78.21 12.37,78.21 v12.37,77.95
DTR  (via drill 0.35)
  Top 0.203: R23.4 14.31,68.58 | Q6.2 10.68,61.98 14.48,61.98 14.48,65.56 13.63,65.56 13.63,68.58 14.31,68.58 | IC4.23 11.17,69.08 v11.17,69.09 | v15.49,68.58 14.31,68.58
  Bottom 0.203: v11.17,69.09 15.49,69.09 v15.49,68.58
EN
  Top 0.203: U1.3 30.73,49.93 27.99,49.93 27.99,49.2 27.83,49.04 R17.1
FREQ
  Top 0.305: U$1.6 22.82,9.61 23.03,8.12 23.37,7.79 R14.2 24.21,7.79 25.15,8.72 R15.2
GND  (via drill 0.35)
  Top 0.203: IC4.2 8.88,69.08 IC4.THERM
  Top 0.254: U$1.5 20.13,9.11 19.95,9.29 | U$1.EXP 19.95,9.29 | 19.95,9.29 19.84,9.39 19.84,11.19 U$1.12
  other vias: 36.83,15.24 37.08,28.7 37.08,30.23 37.08,27.94 36.07,14.48 34.29,13.72 36.07,11.43 36.83,10.67 30.48,13.72 4.06,13.21 4.83,13.21 4.06,12.45 3.3,12.45 8.64,3.05 13.92,13.72 3.3,13.21 10.92,10.16 26.42,4.11 10.92,10.97 18.03,12.55 18.03,11.68 13.06,13.72 25.65,9.91 2.03,30.48 1.27,30.48 2.03,31.24 1.27,31.24 6.1,45.72 6.1,46.48 5.33,46.48 6.1,44.96 5.33,45.72 6.1,44.2 5.33,44.96 5.33,44.2 6.1,43.43 5.33,42.67 5.33,43.43 6.1,42.67 34.14,45.62 34.9,45.62 32.51,48.26 38.05,48.16 35.66,44.86 37.34,48.16 36.63,48.16 20.83,52.07 31.75,48.26 9.91,58.98 4.24,67.74 2.24,63.73 8.92,77.09 14.27,76.66 16.66,73.28 31.75,13.72 33.02,13.72 36.83,14.48 36.07,15.24 10.41,15.24 10.16,10.16 9.91,17.78 10.67,17.78 10.67,17.02 9.91,17.02 9.91,16.26 10.67,16.26 36.83,13.72 29.21,13.72 36.07,12.95 36.07,13.72 36.07,12.19 36.83,11.43 36.83,12.95 36.83,12.19 36.58,21.84 36.58,22.61 36.32,27.18 37.08,27.18 35.56,28.7 36.32,28.7 37.08,29.46 34.04,29.46 35.56,29.46 36.32,29.46 34.04,30.73 35.56,30.23 36.32,30.23 34.04,32 34.8,32 34.8,30.73 36.32,27.94 36.58,24.13 36.58,23.37 34.8,29.46 20.5,4.01 5.64,74.73 6.15,63.8 6.1,61.72 11,70.33 18.03,38.61 18.03,37.85 18.03,36.32 18.03,37.08 17.27,36.32 18.8,38.61 20.02,9.45 20.98,10.41 20.02,10.41 20.98,9.5 17.27,37.08 17.27,38.61 17.27,37.85 5.59,76.71 34.14,44.86 35.66,45.62 34.9,44.86 33.27,48.26 35.92,48.16 5.23,56.64 6.05,56.64 18.8,37.85 18.8,37.08 18.8,36.32 1.27,29.72 2.03,29.72 34.04,48.26 3.48,66.22 13.28,76.68 4.24,54.28 4.24,66.22 4.24,66.98 13.08,1.02 14,1.02 14.91,1.02 15.82,1.02 16.74,1.02 17.7,1.02 18.67,1.02 19.63,1.02 20.6,1.02 21.56,1.02 22.53,1.02 23.5,1.02 24.46,1.02 25.37,1.02 26.34,1.02 27.3,1.02 28.27,1.02 12.12,1.02 11.15,1.02 1.22,20.52 1.98,20.52 1.22,19.61 1.98,19.61 1.22,18.75 1.98,18.75 5.84,32.92 5.84,32.21 5.08,32.92 5.08,32.21 27.18,66.55 28.04,66.55 27.18,65.74 27.18,64.87 27.18,64.06 28.04,65.74 28.04,64.87 28.04,64.06 28.91,66.55 28.91,65.74 28.96,64.87 28.96,64.06 29.77,66.55 29.77,65.74 29.82,64.87 29.82,64.06 30.68,66.55 30.68,65.68 30.68,64.87 30.68,64.06 31.6,66.55 31.6,65.68 31.55,64.82 31.55,64.06 23.62,56.08 24.38,56.08 25.15,56.08 25.91,56.08 23.62,56.9 24.38,56.9 15.19,59.99 16.56,53.09
  pour Top (isolate 0.305, no thermals): 9.4,19.05 13.72,19.05 13.72,15.75 9.4,15.75
  pour Top (isolate 0.152, rank 2): 0,80.01 0,0 39.37,0 39.37,80.01
  pour Bottom (isolate 0.254, rank 2): 0,80.01 0,0 39.37,0 39.37,80.01
GPIO0  (via drill 0.35)
  Top 0.203: X8.25 37.03,55.85 37.03,62.08 v35.61,63.5 35.05,64.06 35.05,67.31 v32.26,70.1 | v13.97,62.99 Q6.3 | v3.81,72.14 3.35,71.67 IO0.2 | v9.91,60.2 7.42,60.2 U2.3
  Bottom 0.203: v35.61,63.5 34.75,62.64 19.76,62.64 19.76,53.14 17.27,53.14 17.27,62.99 v13.97,62.99 9.91,62.99 v9.91,60.2 | v3.81,72.14 4.21,72.53 29.83,72.53 v32.26,70.1
GPIO0_5V
  Top 0.203: U2.4 4.74,60.07 2.51,60.07 2,59.55 2,58.49 1.64,58.12 J3.1_B
  Bottom 0.203: J3.1_B J3.1_A
GPIO12
  Top 0.203: X8.14 18.68,55.85 D2.A
  Top 0.305: X8.14 20.78,56.04 19.69,56.04 19.61,56.12 19.61,65.28 18.58,65.28 R43.1
HSW  (via drill 0.35)
  Top 0.305: R7.1 17.32,14.06 | 21.92,12.4 C5.1 21.58,13.09 v22.2,13.72 18.63,13.72 18.29,14.06 | R10.1 23.88,4.59 v23.88,5.59
  Top 0.406: Q2.5 18.29,14.06 17.32,14.06 | U$1.8 21.92,12.4
  Bottom 0.305: v23.88,5.59 23.88,12.1 23.37,12.6 21.24,12.6 21.24,12.76 v22.2,13.72
  other vias: 16.51,24.89 17.27,24.89 18.03,24.89 18.8,24.89 16.51,24.13 17.27,24.13 18.03,24.13 18.8,24.13 16.51,23.37 17.27,23.37 18.03,23.37 18.8,23.37 16.51,22.61 17.27,22.61 18.03,22.61 18.8,22.61 16.51,21.84 17.27,21.84 18.03,21.84 18.8,21.84 16.51,21.08 17.27,21.08 18.03,21.08 18.8,21.08 16.51,20.32 17.27,20.32 18.03,20.32 18.8,20.32 14.73,18.29 15.49,18.29 16.26,18.29 14.73,17.53 15.49,17.53 16.26,17.53 14.73,16.76 15.49,16.76 15.49,15.24 14.73,16 14.73,15.24 15.49,16 16.26,16.76 16.26,16 16.26,15.24
  pour Bottom (isolate 0.305, no thermals): 12.45,25.65 12.45,19.56 14.22,19.56 14.22,14.48 19.05,14.48 19.05,25.65
  pour Top (isolate 0.305, no thermals): 12.45,25.65 21.08,25.65 21.08,15.75 19.05,15.75 19.05,14.48 14.22,14.48 14.22,19.56 12.45,19.56
N$1
  Top 0.254: R2.2 20.3,45.08 IC3.8
N$2
  Top 0.203: 22.41,45.49 R2.1 23.79,45.31 R4.1 23.89,45.21 24.64,45.21 24.64,48.48 R3.2 C10.2
N$3
  Top 0.406: R5.2 12.66,46.3 15.08,46.3 15.08,45.13 IC3.5
N$4
  Top 0.203: IC3.1 17.72,47.04 20.46,47.04 R1.1
N$5
  Top 0.203: 15.84,45.14 IC3.6 15.78,44.03 R11.2
N$6
  Top 0.61: C1.1 R5.1
N$7
  Top 0.152: R12.2 17.41,8.69 17.41,9.13 18.39,10.11 U$1.14
N$8
  Top 0.305: C3.2 15.24,10.1 15.24,10.41 16.42,11.6 R7.2
N$9
  Top 0.203: D2.C 17.91,52.58 15.8,52.58 15.39,52.98 15.39,54.41 | R6.2 18.29,56.76 17.31,55.78 15.39,55.78 15.39,54.52 R20.2 15.39,54.41 | BK_EN.1 13.77,54.41 15.39,54.41
N$10
  Top 0.203: U3.5 15.56,57.45 R27.1
N$11
  Top 0.203: R9.1 11.18,6.6 13.97,6.6 13.97,8.89 | C3.1 16.75,8.89 13.97,8.89 | C20.1 13.97,10.33 13.97,8.89
  Top 0.254: U$1.13 17.45,10.61 C3.1 | 5-12V.2 R9.1
N$12
  Top 0.305: U$1.4 21.58,8.46 23.23,6.81 24.79,6.81 24.79,1.88 7.87,1.88 7.87,10.41 12.32,14.86 Q2.4
N$13
  Top 0.305: Q1.4 20.81,14.86 21.37,14.3 22.76,14.3 22.76,10.11 U$1.7
N$14
  Top 0.305: U$1.3 20.78,8.08 21.08,7.77 21.64,7.77 22.2,7.21 R10.2 22.2,6.66
N$15  (via drill 0.35)
  Top 0.203: D1.C 18.71,3.9 v17.37,3.9 | v18.8,12.6 19.88,12.6 C5.2
  Top 0.254: U$1.10 20.77,11.85 C5.2
  Bottom 0.203: v17.37,3.9 18.8,3.9 v18.8,12.6
N$17
  Top 0.254: 5-12V.1 12.95,4.27 R8.2
N$18
  Top 0.254: 5-12V.3 9.64,4.03 9.6,4.03 9.4,4.23 R13.2
N$21
  Top 0.305: D13.A 16.83,65.21 R43.2
N$23
  Top 0.203: Q7.1 16.32,61.86 18.29,59.89 R6.1
N$24
  Top 0.203: Q4.1 24.91,43.88 R19.1
N$25
  Top 0.508: IC3.3 15.78,50.01
  Top 0.61: 15.21,50.57 L3.1 | 15.78,50.01 15.21,50.57 | 15.21,50.57 14.76,51.02 C1.2
N$26  (via drill 0.35)
  Top 0.203: R24.1 R19.2 25.65,47.37 25.81,47.52 25.81,51.46 v26.16,51.82 | Q7.3 18.51,60.93 | 18.51,60.93 18.73,60.71 | v15.6,61.01 15.64,61.06 15.64,62.45 15.78,62.59 16.87,62.59 18.44,62.59 18.51,62.52 18.51,60.93
  Bottom 0.203: v26.16,51.82 25.38,52.59 16.2,52.59 16.07,52.73 16.07,60.54 v15.6,61.01
N$28
  Top 0.203: U2.5 3.19,59.33 R16.1
N$45
  Top 0.203: 13.21,64.01 13.29,64.01 13.29,68.61 R23.5
  Top 0.254: 13.21,64.01 11.68,64.01 11.68,62.99 9.38,62.99 Q5.1
N$48
  Top 0.254: Q6.1 11.79,65.04 11.79,66.91 R23.7
NEODATA_3V  (via drill 0.35)
  Top 0.203: 35.05,54.6 X8.24 35.19,53.13 v35.1,53.03 | U3.3 12.11,56.39 v10.67,56.39
  Bottom 0.203: 13.97,53.09 v10.67,56.39 16.36,50.7 26.67,50.7 29.01,53.03 v35.1,53.03
NEODATA_5V
  Top 0.203: 11.43,55.68 10.67,54.92 10.67,53.85 8.64,51.82 J3.2_A | 14.02,55.68 14.6,56.26 U3.4
  Top 0.254: 11.43,55.68 14.02,55.68 | J3.2_B J3.2_A
PWIN  (via drill 0.35)
  other vias: 36.83,39.32 37.59,39.32 36.83,40.13 37.59,40.13 38.35,37.59 38.35,36.83 38.35,36.07 38.35,35.31 38.35,34.54 36.83,37.59 36.83,36.58 36.83,35.56 36.83,34.54
  pour Top (isolate 0.305, no thermals): 28.7,43.69 39.12,43.69 39.12,33.02 32.51,33.02 32.51,40.39 28.7,40.39
  pour Bottom (isolate 0.305, no thermals): 35.81,43.69 39.12,43.69 39.12,33.02 35.81,33.02
RESET  (via drill 0.35)
  Top 0.152: RST.2 v2.29,61.98 | v7.11,61.57 7.11,62.82 Q5.3
  Top 0.203: C32.1 4.83,64.59 10.3,64.59 11.38,65.67 11.38,66.07 11.35,66.1 11.35,67.33 11.73,67.71 12.39,67.71 | Q5.3 5.42,62.99 C32.1 | C32.1 4.83,63.46 | 12.39,67.71 R23.6 | X8.3 20.43,69.29 v17.48,69.29 | v12.09,70.1 12.09,69.7 11.73,69.34 11.73,68.38 12.39,67.71
  Bottom 0.152: v2.29,61.98 2.79,62.48 7.11,62.48 v7.11,61.57
  Bottom 0.203: v17.48,69.29 16.66,70.1 v12.09,70.1
RTS
  Top 0.203: IC4.19 10.13,65.1 9.95,64.92 4.69,64.92 4.1,64.33 4.1,61.24 4.23,61.11 5.59,61.11 5.79,60.91 8.3,60.91 8.61,61.22 8.51,61.32 | Q5.2 8.36,63.94 8.36,61.47 8.5,61.33 8.51,61.32 | R23.2 14.42,66.8 14.99,66.8 15.09,66.7 15.09,65.23 14.81,65.23 14.81,61.84 14.62,61.65 11.61,61.65 11.28,61.32 8.51,61.32
RXD0  (via drill 0.35)
  Top 0.203: IC4.21 v11.17,68.08 v11.17,68.07 | X8.34 36.9,67.28 34.18,70 v33.93,70
  Bottom 0.203: v33.93,70 33.07,69.14 33.07,68.07 19.1,68.07 19.1,53.85 18.04,53.85 18.04,68.03 14.94,68.03 14.94,68.07 v11.17,68.07
TXD0  (via drill 0.35)
  Top 0.203: IC4.20 10.61,67.58 10.61,67.52 10.89,67.52 v10.89,65.87 | X8.35 36.34,68.55 36.34,70.33 35.4,71.27 v34.54,71.27
  Bottom 0.203: v34.54,71.27 34.54,71.12 34.75,70.92 34.75,67.42 19.43,67.42 19.43,53.47 17.66,53.47 17.66,65.87 v10.89,65.87
VBUS  (via drill 0.35)
  Top 0.203: R3.1 C10.1 21.15,52.83 19.83,52.83 | v1.22,62.28 1.22,59.09 R16.2 | U2.6 4.96,58.25 v4.01,57.3 | R27.2 15.71,58.41 v14.99,59.13
  Top 0.254: IC4.8 6.12,69.09 v4.32,69.09
  Top 0.305: v4.32,69.09 1.68,69.09 1.12,68.53 1.12,62.38 v1.22,62.28 | U3.6 14.6,58.74 v14.99,59.13
  Top 0.406: U1.1 30.14,51.98 C16.1 28.9,50.74 R17.2
  Top 0.508: 19.83,53.49 18.61,54.71 v18.59,54.71 | X6.B4A9 8.95,72.24 5.33,72.24 v4.9,71.81 | X6.A4B9 13.75,72.55 v13.13,71.93
  Top 0.61: R17.2 27.11,52.68 26.96,52.83 19.83,52.83 | C2.2 19.83,52.83 | 19.83,52.83 19.83,53.49
  Top 0.813: L3.2 18.08,50.67 C2.2 C8.2
  Bottom 0.305: v4.32,69.09 4.9,69.67 4.9,71.12 | v1.22,62.28 1.22,60.1 v4.01,57.3 4.22,57.51 13.36,57.51 v14.99,59.13
  Bottom 0.406: 5.08,71.12 13.13,71.12 18.59,71.12 v18.59,54.71
  Bottom 0.508: v4.9,71.81 4.9,71.12 5.08,71.12 | v13.13,71.93 13.13,71.12
VDD  (via drill 0.35)
  Top 0.203: D1.A 19.25,6.69 18.52,5.95 18.52,4.91 v18.09,4.47 | R12.1 14.3,7.28 14.3,6.47 13.97,6.14 13.97,4.52 14.48,4.52 v14.48,5.08 14.4,5.08
  Top 0.305: U$1.2 U$1.1 19.25,7.93 D1.A 19.56,6.94 19.66,6.84 C6.2 | v14.48,5.08 13.58,4.18 C21.2
  Bottom 0.203: v14.48,5.08 14.99,4.57 17.98,4.57 v18.09,4.47
VIN  (via drill 0.35)
  Top 0.203: R11.1 18.35,43.38 18.36,43.38 18.55,43.18 | Q4.2 22.1,41.89 22.1,40.64 | F1.P$2 27.18,37.49 R24.2
  Top 0.305: U$1.16 18.82,9.11 18.36,8.65 18.36,6.57 18.14,6.34 18.14,5.69 16.76,4.32 16.26,4.32 16.26,2.79 16.51,2.54 17.27,2.54 17.48,2.34 23.42,2.34 v23.42,3.96 | R15.1 25.65,6.1 v26.42,5.33 28.3,5.33 28.3,13.3 27.53,13.3 C25.1 26.11,13.04 25.86,13.3 24.89,13.3
  Top 0.406: IC3.2 16.43,46.28 19.25,46.28 v19.3,46.23 | v19.81,43.18 18.55,43.18 | C9.2 18.36,43.38
  Top 0.813: D3.C 24.27,40.64 22.1,40.64 19.81,40.64 19.81,41.55 C9.2
  Top 1.016: C7.2 24.68,13.08 24.89,13.3 24.89,14.1 Q1.5 | 25.86,13.3 C12.2
  Bottom 0.305: v23.42,3.96 25.35,3.96 25.35,5.33 v26.42,5.33
  Bottom 0.406: v19.3,46.23 19.3,43.69 v19.81,43.18
  other vias: 26.92,21.08 28.45,21.84 26.92,20.32 28.45,19.05 26.92,18.29 28.45,18.29 29.21,21.84 29.21,19.05 29.21,18.29 25.4,21.08 24.64,21.08 23.37,21.08 25.4,20.32 24.64,20.32 23.37,20.32 26.92,16.51 28.45,17.53 29.21,17.53 28.45,23.62 29.21,23.62 28.45,25.4 29.21,25.4 28.45,26.92 29.21,26.92 28.45,28.45 29.21,28.45 28.45,29.97 29.21,29.97 28.45,31.5 29.21,31.5 23.88,34.54 28.45,33.02 29.21,33.02 29.21,35.56 29.97,35.56 29.97,34.8 24.64,34.54 22.35,35.81 26.92,33.02 25.4,34.54 23.88,33.78 24.64,33.78 26.92,31.5 25.4,31.5 23.88,31.5 25.4,33.78 28.96,38.61 29.21,34.8 29.97,36.32 29.21,36.32 29.97,37.08 29.21,37.08 26.67,38.61 22.35,38.86 22.35,37.85 22.35,36.83 22.35,18.29 22.35,17.53 22.35,16.76 22.35,16 23.11,16 23.11,16.76 23.11,17.53 23.11,18.29 23.88,18.29 23.88,17.53 23.88,16.76 23.88,16 22.35,15.24 23.11,15.24 23.88,15.24
  pour Top (isolate 0.305, no thermals): 20.9,39.83 31.52,39.83 31.52,32.89 30.45,32.89 30.45,26.8 33.96,26.8 33.96,14.71 21.54,14.71 21.54,23.88 26.8,23.88 26.8,30.45 20.9,30.45
  pour Bottom (isolate 0.305, no thermals): 21.82,39.83 31.52,39.83 31.52,32.89 30.45,32.89 30.45,26.8 33.96,26.8 33.96,14.71 21.54,14.71 21.54,23.88 26.8,23.88 26.8,30.45 21.82,30.45
VOUT  (via drill 0.35)
  Top 0.203: 9.14,7.71 9.14,8.89 8.26,8 8.26,4.55 v8.43,4.37 | v2.44,9.75 2.44,17.27 4.06,18.9 v4.06,19.3
  Top 0.305: L1.2 13.66,30.42 | 9.14,7.71 R13.1 | R8.1 12.95,8.64 12.7,8.89 11.68,8.89 | 11.68,8.89 9.14,8.89 | C20.2 12.1,11.18 11.94,11.18 11.68,10.92 11.68,8.89
  Bottom 0.203: v8.43,4.37 8.03,4.37 2.64,9.75 v2.44,9.75
  other vias: 17.02,30.73 17.02,29.97 17.02,29.21 17.78,30.73 17.78,29.97 17.78,29.21 16.26,30.73 16.26,29.97 16.26,29.21 4.06,21.59 4.06,20.83 4.06,20.07 4.83,19.3 10.16,23.62 7.87,22.86 7.87,23.62 8.64,23.62 9.4,23.62 8.64,22.86 12.19,40.13 11.43,38.61 11.43,37.85 11.43,37.08 11.43,36.32 5.33,35.31 6.1,36.07 6.1,35.31 5.33,36.83 5.33,36.07 5.33,37.59 6.1,37.59 6.1,36.83 11.43,35.56 9.4,22.86 4.83,20.07 4.83,20.83 4.83,21.59 11.43,34.8 5.33,38.35 6.1,38.35 5.33,39.12 6.1,39.12 12.19,38.61 12.19,37.85 12.19,37.08 12.19,36.32 12.19,35.56 12.19,34.8 11.38,31.6 12.14,31.6 11.38,30.84 12.14,30.84 11.38,30.07 12.14,30.07 11.38,29.31 12.14,29.31
  pour Top (isolate 0.305, no thermals): 0.25,33.78 0.25,41.15 13.97,41.15 13.97,33.02 19.3,33.02 19.3,26.16 11.99,26.16 11.99,20.88 8.89,20.88 8.89,14.48 3.56,14.48 3.56,25.15 8.13,25.15 8.13,33.78
  pour Bottom (isolate 0.305): 0.25,33.78 0.25,41.15 13.97,41.15 13.97,33.02 19.3,33.02 19.3,26.16 11.99,26.16 11.99,19.46 8.89,19.46 8.89,14.48 3.56,14.48 3.56,25.15 8.13,25.15 8.13,33.78

### Text on the board
tNames: esp32 | V3
bNames: CK | DATA | GND | GND | GND | 5V|12V | 8V-24V